# EAGLE schematic bus (EAGLE 6.6.0)
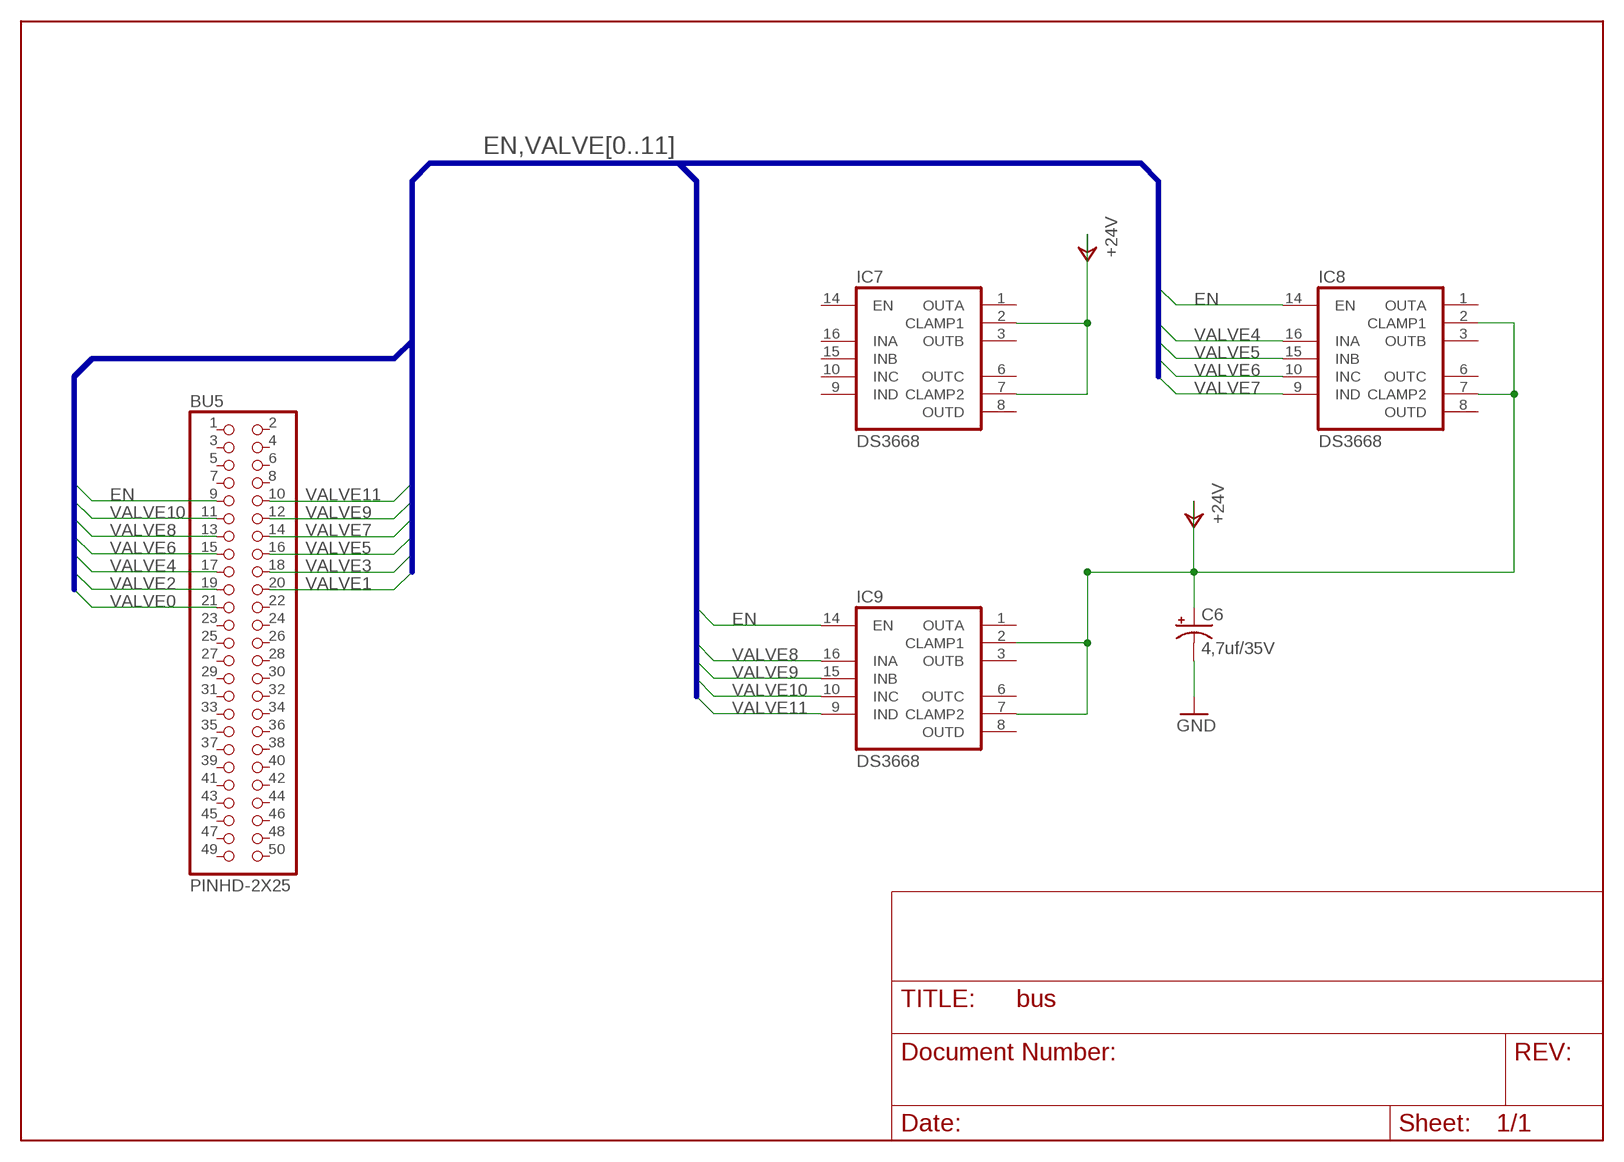
[diagram p0: schematic, sheet 1]

## Parts
BU5  PINHD-2X25  [2X25]
C6  4,7uf/35V  CPOL-USE2.5-6  [E2,5-6]
IC7  DS3668  [DIL-16]
IC8  DS3668  [DIL-16]
IC9  DS3668  [DIL-16]

## Nets
+24V: C6.+ IC7.2(CLAMP1) IC7.7(CLAMP2) IC8.2(CLAMP1) IC8.7(CLAMP2) IC9.2(CLAMP1) IC9.7(CLAMP2)
EN: BU5.9 IC8.14(EN) IC9.14(EN)
GND: C6.-
VALVE0: BU5.21
VALVE1: BU5.20
VALVE2: BU5.19
VALVE3: BU5.18
VALVE4: BU5.17 IC8.16(INA)
VALVE5: BU5.16 IC8.15(INB)
VALVE6: BU5.15 IC8.10(INC)
VALVE7: BU5.14 IC8.9(IND)
VALVE8: BU5.13 IC9.16(INA)
VALVE9: BU5.12 IC9.15(INB)
VALVE10: BU5.11 IC9.10(INC)
VALVE11: BU5.10 IC9.9(IND)
Unconnected: BU5.1 BU5.2 BU5.3 BU5.4 BU5.5 BU5.6 BU5.7 BU5.8 BU5.22 BU5.23 BU5.24 BU5.25 BU5.26 BU5.27 BU5.28 BU5.29 BU5.30 BU5.31 BU5.32 BU5.33 BU5.34 BU5.35 BU5.36 BU5.37 BU5.38 BU5.39 BU5.40 BU5.41 BU5.42 BU5.43 BU5.44 BU5.45 BU5.46 BU5.47 BU5.48 BU5.49 BU5.50 IC7.1(OUTA) IC7.3(OUTB) IC7.6(OUTC) IC7.8(OUTD) IC7.9(IND) IC7.10(INC) IC7.14(EN) IC7.15(INB) IC7.16(INA) IC8.1(OUTA) IC8.3(OUTB) IC8.6(OUTC) IC8.8(OUTD) IC9.1(OUTA) IC9.3(OUTB) IC9.6(OUTC) IC9.8(OUTD)

## Buses
EN,VALVE[0..11]

## Power pins joined to a net without a drawn wire
VCC: IC7.11(VCC) IC8.11(VCC) IC9.11(VCC)
VSS: IC7.4(VSS) IC7.5(VSS) IC7.12(VSS) IC7.13(VSS) IC8.4(VSS) IC8.5(VSS) IC8.12(VSS) IC8.13(VSS) IC9.4(VSS) IC9.5(VSS) IC9.12(VSS) IC9.13(VSS)

## Library data of the parts
BU5 = PINHEAD:PINHD-2X25: PIN HEADER
C6 = rcl:CPOL-US: POLARIZED CAPACITOR, American symbol
IC7-IC9 = klaus:DS3668